# Altium schematic sheet RK3562-USB-PCIe-PHY.SchDoc
size 381 x 237 mm; SheetNumber: 12; SheetTotal: 32
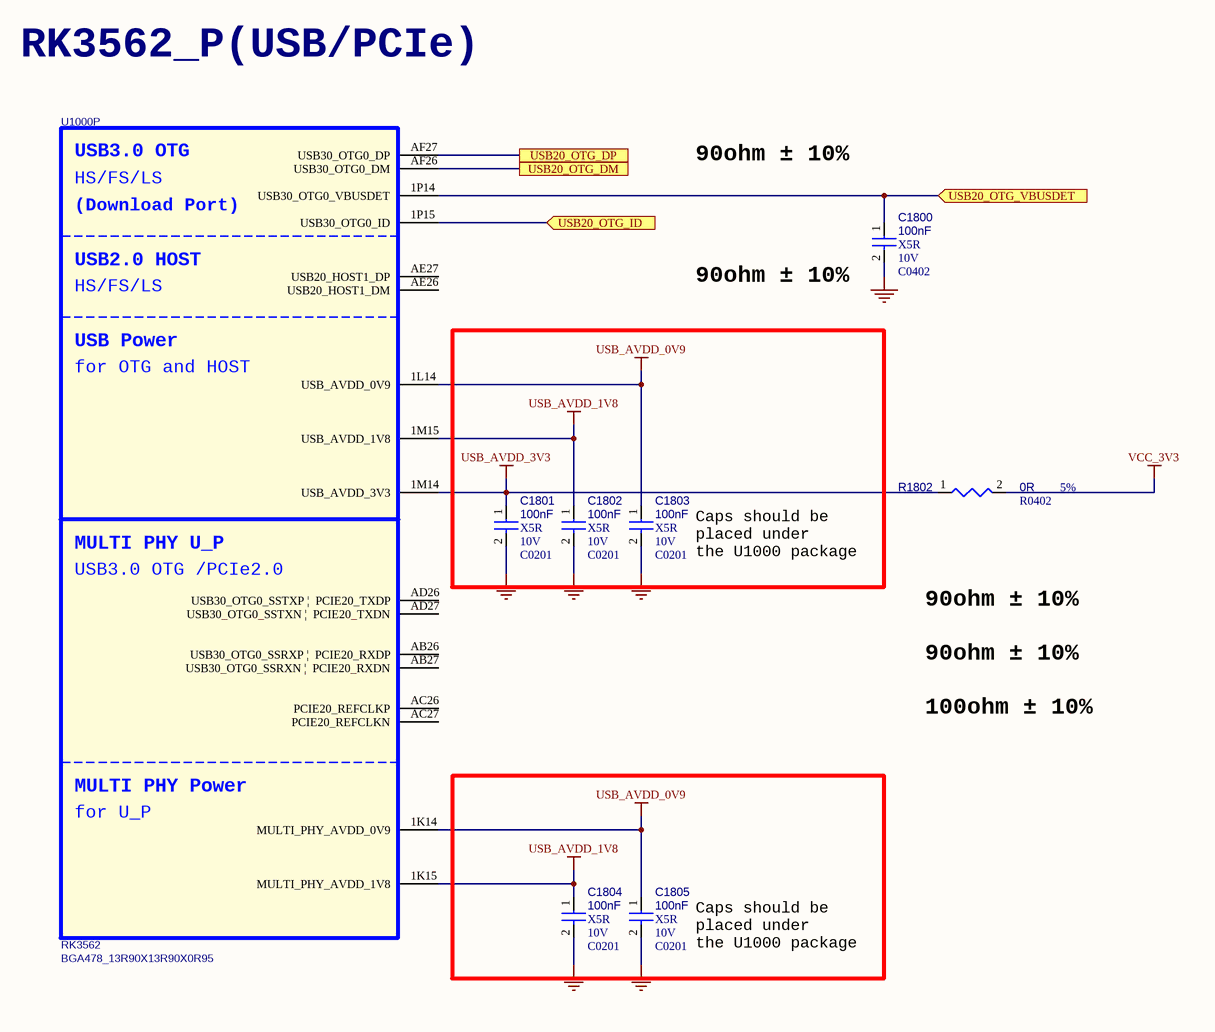
[diagram p0: RK3562-USB-PCIe-PHY.SchDoc]

## Parts
C1800  100nF  Dielectric: X5R  Voltage: 10V  [C0402]
C1801  100nF  Dielectric: X5R  Voltage: 10V  [C0201]
C1802  100nF  Dielectric: X5R  Voltage: 10V  [C0201]
C1803  100nF  Dielectric: X5R  Voltage: 10V  [C0201]
C1804  100nF  Dielectric: X5R  Voltage: 10V  [C0201]
C1805  100nF  Dielectric: X5R  Voltage: 10V  [C0201]
R1802  0R  Tolerance: 5%  [R0402]
U1000  RK3562  [BGA478_13R90X13R90X0R95]  (part P of 16)

## Ports
USB20_OTG_DM (see CONTROLLER-RK3562[6D]), USB20_OTG_DP (see CONTROLLER-RK3562[6D]), USB20_OTG_ID (in, see CONTROLLER-RK3562[6D]), USB20_OTG_VBUSDET (in, see CONTROLLER-RK3562[6D])

## Nets
GND: C1800.2 C1801.2 C1802.2 C1803.2 C1804.2 C1805.2
USB_AVDD_0V9: C1803.1 C1805.1 U1000.1K14(MULTI_PHY_AVDD_0V9) U1000.1L14(USB_AVDD_0V9)
USB_AVDD_1V8: C1802.1 C1804.1 U1000.1K15(MULTI_PHY_AVDD_1V8) U1000.1M15(USB_AVDD_1V8)
USB_AVDD_3V3: C1801.1 R1802.1 U1000.1M14(USB_AVDD_3V3)
VCC_3V3: R1802.2
USB20_OTG_DM: U1000.AF26(USB30_OTG0_DM) ; port USB20_OTG_DM
USB20_OTG_DP: U1000.AF27(USB30_OTG0_DP) ; port USB20_OTG_DP
USB20_OTG_ID: U1000.1P15(USB30_OTG0_ID) ; port USB20_OTG_ID
USB20_OTG_VBUSDET: C1800.1 U1000.1P14(USB30_OTG0_VBUSDET) ; port USB20_OTG_VBUSDET

Not connected (* = marked no-connect by the designer): U1000 AB26(USB30_OTG0_SSRXP_|__PCIE20_RXDP) AB27(USB30_OTG0_SSRXN_|__PCIE20_RXDN) AC26(PCIE20_REFCLKP) AC27(PCIE20_REFCLKN) AD26(USB30_OTG0_SSTXP_|__PCIE20_TXDP) AD27(USB30_OTG0_SSTXN_|__PCIE20_TXDN) AE26(USB20_HOST1_DM) AE27(USB20_HOST1_DP)

## Notes on the sheet
- RK3562_P(USB/PCIe)
- 90ohm ± 10%
- Caps should be
  placed under
  the U1000 package
- 100ohm ± 10%
- (in symbol SOC_RK3562, part P) USB3.0 OTG; HS/FS/LS; (Download Port); USB2.0 HOST; USB Power; for OTG and HOST; MULTI PHY U_P; USB3.0 OTG /PCIe2.0; MULTI PHY Power; for U_P

## Library data of the parts
C1800 = CAP NP: cap,100.00nF,+/-10%,10V,X5R,C0402; Part Reference: C1800; Manufacturer PN: C1005X5R1A104K050BA; Manufacturer: TDK; Tolerance: 10%; Priority: A; PCB Footprint: C0402; Value: 100nF; Created by: JJJ; Part Type: C0402; RK PN: C1005X5R1A104K050BA; ClassName: RK
C1801 = CAP NP: cap,100.00nF,+/-10%,10V,X5R,C0201; Part Reference: C1801; Manufacturer: TDK; RK PN: C0603X5R1A104K030BC; Priority: A; Tolerance: 10%; PCB Footprint: C0201; Value: 100nF; Part Type: C0201; Manufacturer PN: C0603X5R1A104K030BC; Created by: JJJ; ClassName: RK
C1802 = CAP NP: cap,100.00nF,+/-10%,10V,X5R,C0201; Part Reference: C1802; Manufacturer: TDK; RK PN: C0603X5R1A104K030BC; Priority: A; Tolerance: 10%; PCB Footprint: C0201; Value: 100nF; Part Type: C0201; Manufacturer PN: C0603X5R1A104K030BC; Created by: JJJ; ClassName: RK
C1803 = CAP NP: cap,100.00nF,+/-10%,10V,X5R,C0201; Part Reference: C1803; Manufacturer: TDK; RK PN: C0603X5R1A104K030BC; Priority: A; Tolerance: 10%; PCB Footprint: C0201; Value: 100nF; Part Type: C0201; Manufacturer PN: C0603X5R1A104K030BC; Created by: JJJ; ClassName: RK
C1804 = CAP NP: cap,100.00nF,+/-10%,10V,X5R,C0201; Part Reference: C1804; Manufacturer: TDK; RK PN: C0603X5R1A104K030BC; Priority: A; Tolerance: 10%; PCB Footprint: C0201; Value: 100nF; Part Type: C0201; Manufacturer PN: C0603X5R1A104K030BC; Created by: JJJ; ClassName: RK
C1805 = CAP NP: cap,100.00nF,+/-10%,10V,X5R,C0201; Part Reference: C1805; Manufacturer PN: C0603X5R1A104K030BC; Manufacturer: TDK; Tolerance: 10%; Priority: A; PCB Footprint: C0201; Value: 100nF; Created by: JJJ; Part Type: C0201; RK PN: C0603X5R1A104K030BC; ClassName: RK
R1802 = RESISTOR: 通用厚膜电阻,0R,+/-5%,R0402,1/16W.; Part Reference: R1802; Manufacturer PN: RC0402JR-070RL; Manufacturer: YAGEO; Wattage: 1/16W; Priority: A; RK PN: 901001446; PCB Footprint: R0402; Value: 0R; Created by: YTL; Part Type: 通用厚膜电阻; ClassName: RK
U1000 = SOC_RK3562: ROCKCHIP SOC; Part Reference: U1000; Manufacturer: Rockchip (瑞芯微); SPLIT_INST: TRUE; SWAP_INFO: (S1+S2+S3+S4+S5+S6+S7+S8+S9+S10+S11+S12+S13+S14+S15+S16); Priority: A; RK PN: 906000425; PCB Footprint: BGA478_13R90X13R90X0R95; Value: RK3562; Created by: JJJ; Manufacturer PN: RK3562; Part Type: SOC; ClassName: RK